# Altium project Tray5.PrjPCB
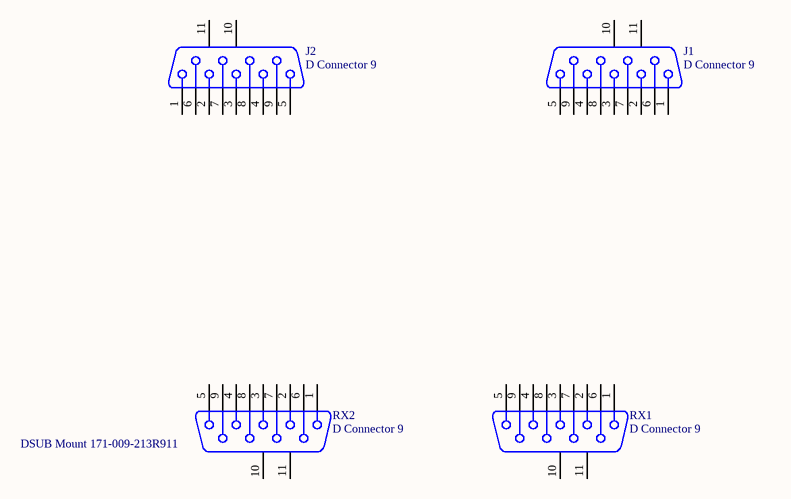
[diagram p0: Tray5.SchDoc]
1 sheet, 4 parts. Net scope: global (net labels, ports and power ports of the same name join across sheets).
Board file: Tray5.PcbDoc

## Sheet Tray5.SchDoc
size A

### Parts
J1  D Connector 9  [DSUB1.385-2H9]
J2  D Connector 9  [DSUB1.385-2H9]
RX1  D Connector 9  [DSUB Upright]
RX2  D Connector 9  [DSUB Upright]

### Nets

Not connected (* = marked no-connect by the designer): J1 1 2 3 4 5 6 7 8 9 10(MH1) 11(MH2); J2 1 2 3 4 5 6 7 8 9 10(MH1) 11(MH2); RX1 1 2 3 4 5 6 7 8 9 10(MH1) 11(MH2); RX2 1 2 3 4 5 6 7 8 9 10(MH1) 11(MH2)

### Notes on the sheet
- (near RX2) DSUB Mount 171-009-213R911

### Library data of the parts
J1 J2 RX1 RX2 = D Connector 9: Receptacle Assembly, 9 Position, Right Angle; PackageDocument: O; Positions: 9; Published: 15-Jun-2001; LatestRevisionDate: 17-Jul-2002; LatestRevisionNote: Re-released for DXP Platform.; DatasheetDocument: 1-Sep-1999; PackageReference: 788750; Publisher: Altium Limited; Orientation: Right Angle; Gender: Receptacle